# Altium schematic sheet BlockDiagram.SchDoc
size A4; SheetNumber: 2; SheetTotal: 5
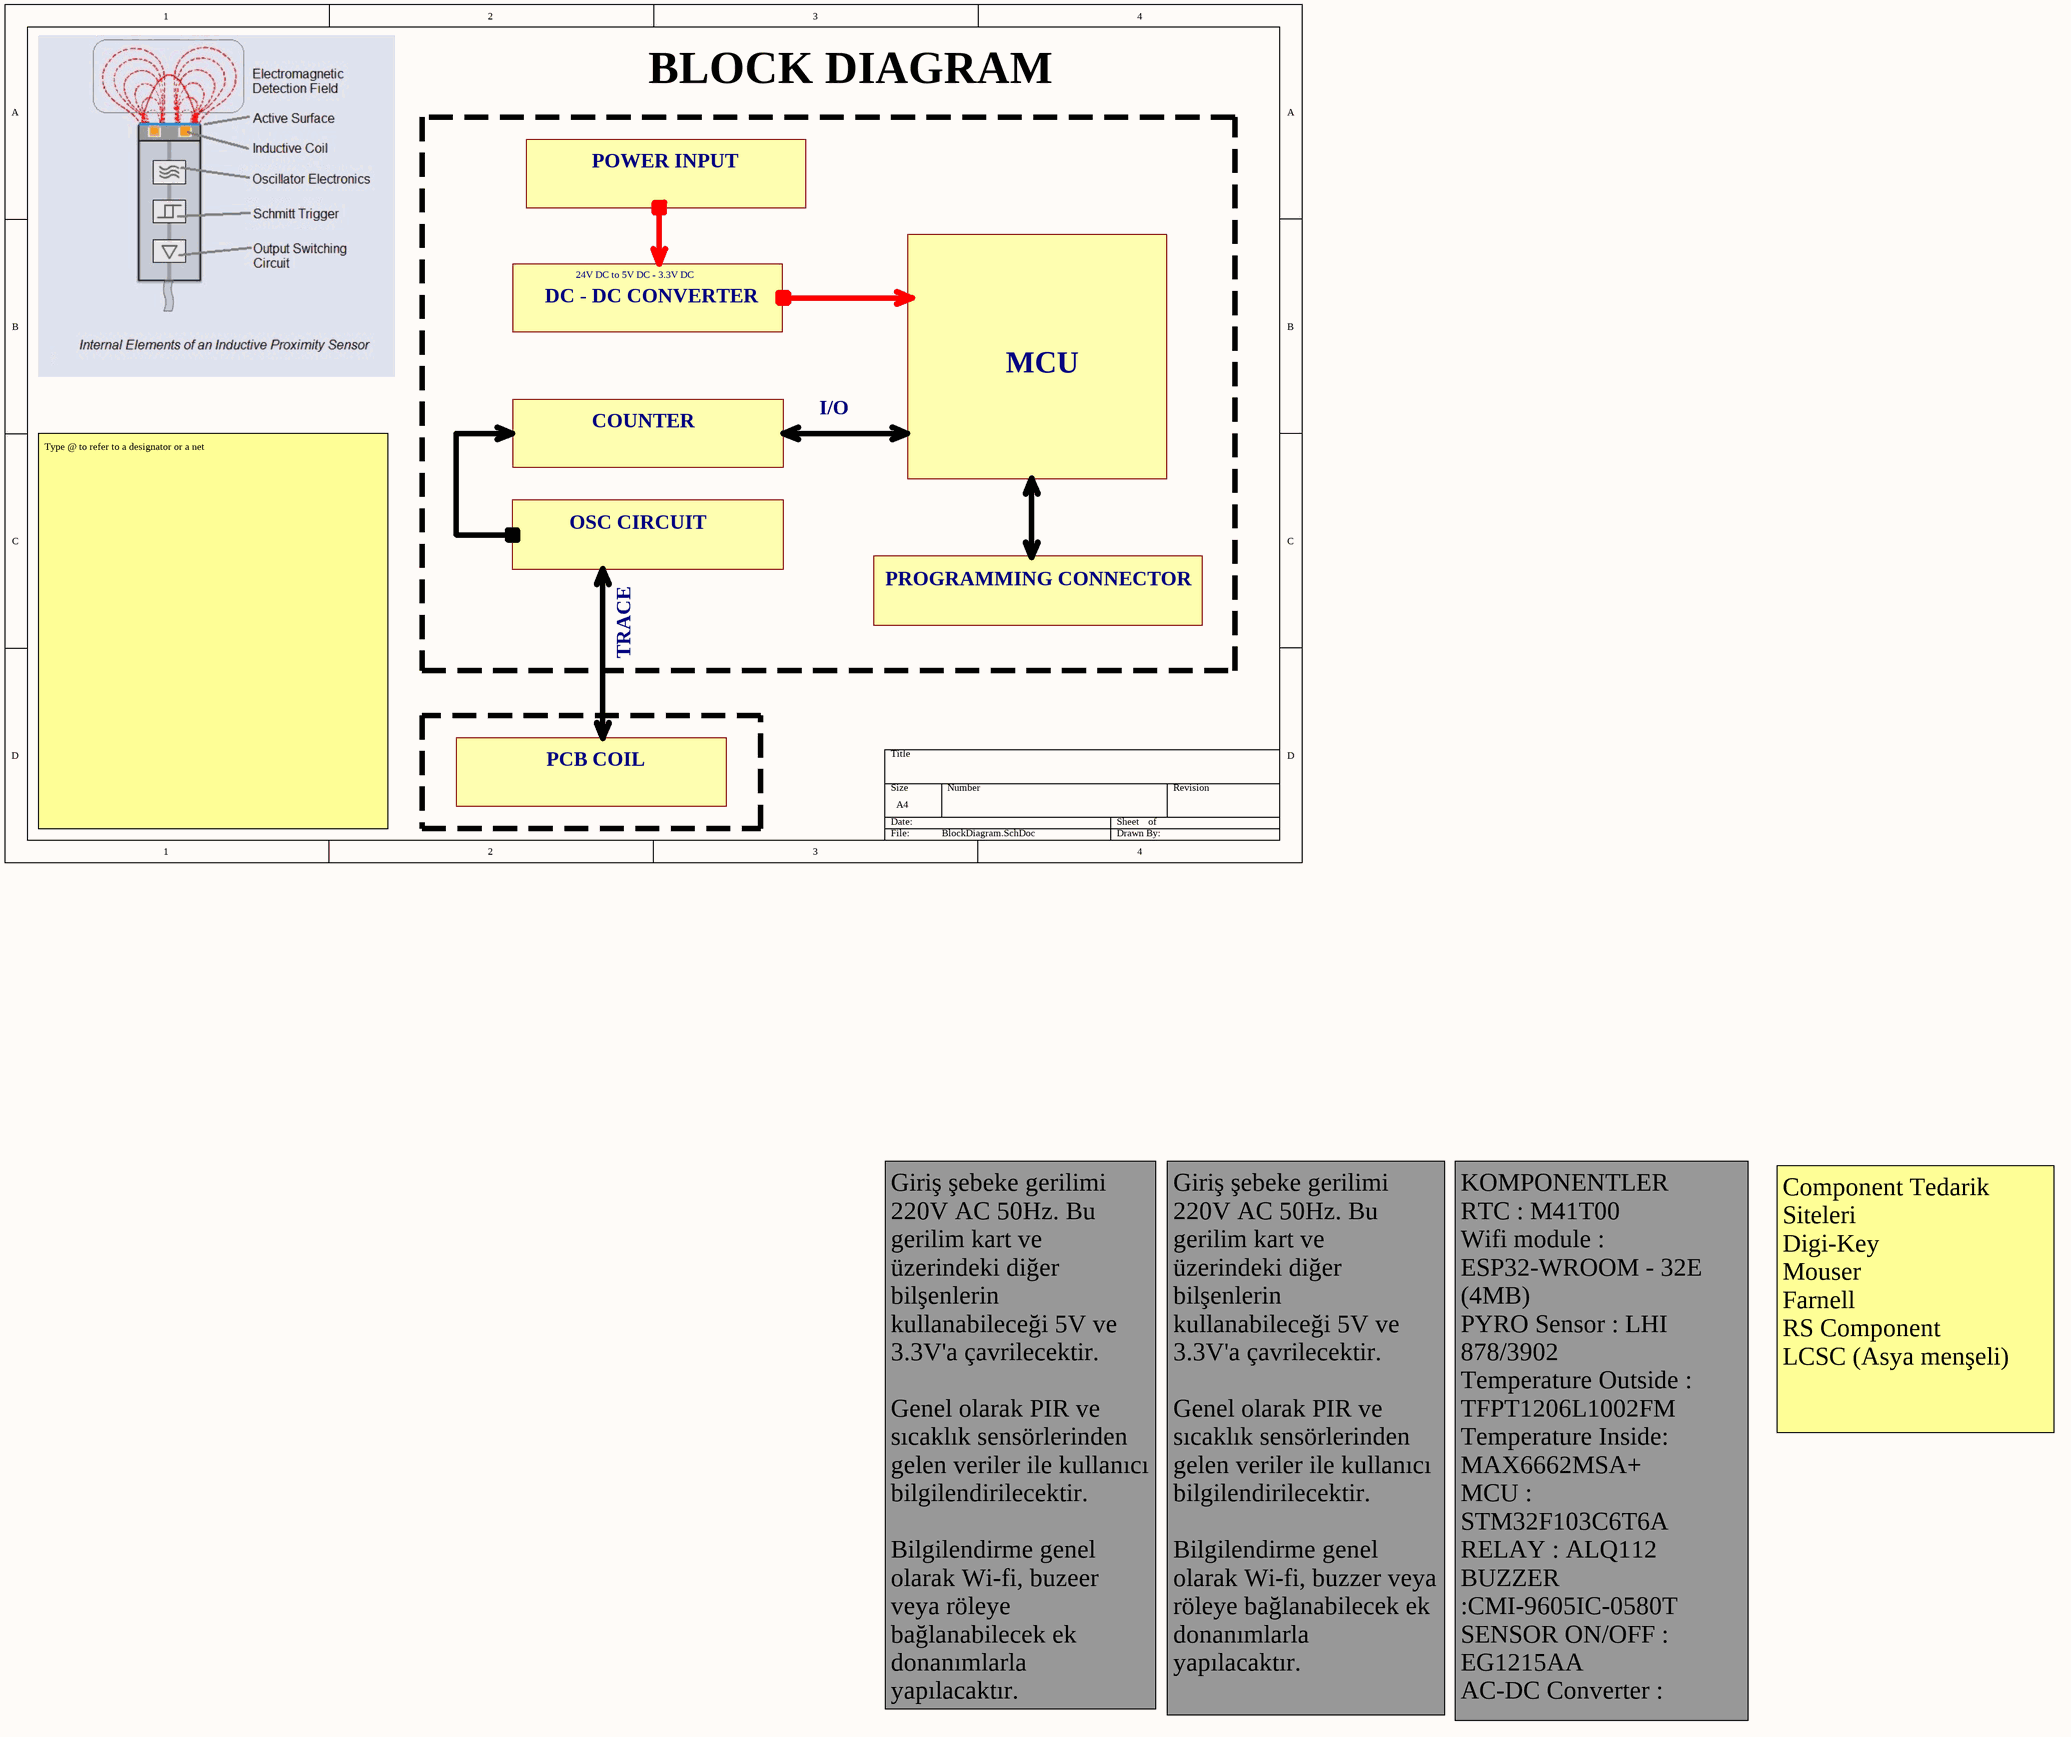
[diagram p0: BlockDiagram.SchDoc]

## Notes on the sheet
- BLOCK DIAGRAM
- POWER INPUT
- DC - DC CONVERTER
- 24V DC to 5V DC - 3.3V DC
- MCU
- COUNTER
- I/O
- OSC CIRCUIT
- PROGRAMMING CONNECTOR
- TRACE
- PCB COIL
- Type @ to refer to a designator or a net
- Component Tedarik Siteleri
  Digi-Key
  Mouser
  Farnell
  RS Component
  LCSC (Asya menşeli)
- Giriş şebeke gerilimi 220V AC 50Hz. Bu gerilim kart ve üzerindeki diğer bilşenlerin kullanabileceği 5V ve 3.3V'a çavrilecektir.
  Genel olarak PIR ve sıcaklık sensörlerinden gelen veriler ile kullanıcı bilgilendirilecektir.
  Bilgilendirme genel olarak Wi-fi, buzeer veya röleye bağlanabilecek ek donanımlarla yapılacaktır.
- Giriş şebeke gerilimi 220V AC 50Hz. Bu gerilim kart ve üzerindeki diğer bilşenlerin kullanabileceği 5V ve 3.3V'a çavrilecektir.
  Genel olarak PIR ve sıcaklık sensörlerinden gelen veriler ile kullanıcı bilgilendirilecektir.
  Bilgilendirme genel olarak Wi-fi, buzzer veya röleye bağlanabilecek ek donanımlarla yapılacaktır.
- KOMPONENTLER
  RTC : M41T00
  Wifi module : ESP32-WROOM - 32E (4MB)
  PYRO Sensor : LHI 878/3902
  Temperature Outside : TFPT1206L1002FM
  Temperature Inside: MAX6662MSA+
  MCU : STM32F103C6T6A
  RELAY : ALQ112
  BUZZER :CMI-9605IC-0580T
  SENSOR ON/OFF : EG1215AA
  AC-DC Converter :
  5VDC LM2675MX-12/NOPB
  3.3VDC AP7361-33E-13
  LED Driver Mosfet : SSM7K357R,LF